# Altium schematic sheet BMS AFE - AFE.SchDoc: Title
size B; Organization: Midnight Sun Solar Rayce Car Team; Address1: University of Waterloo; Address2: 200 University Ave W; Address3: Waterloo, ON, Canada; Address4: N2L 3E9; DocumentNumber: 5; SheetNumber: 5; SheetTotal: 7; Website: www.uwmidsun.com; ProjectName: ProjectName
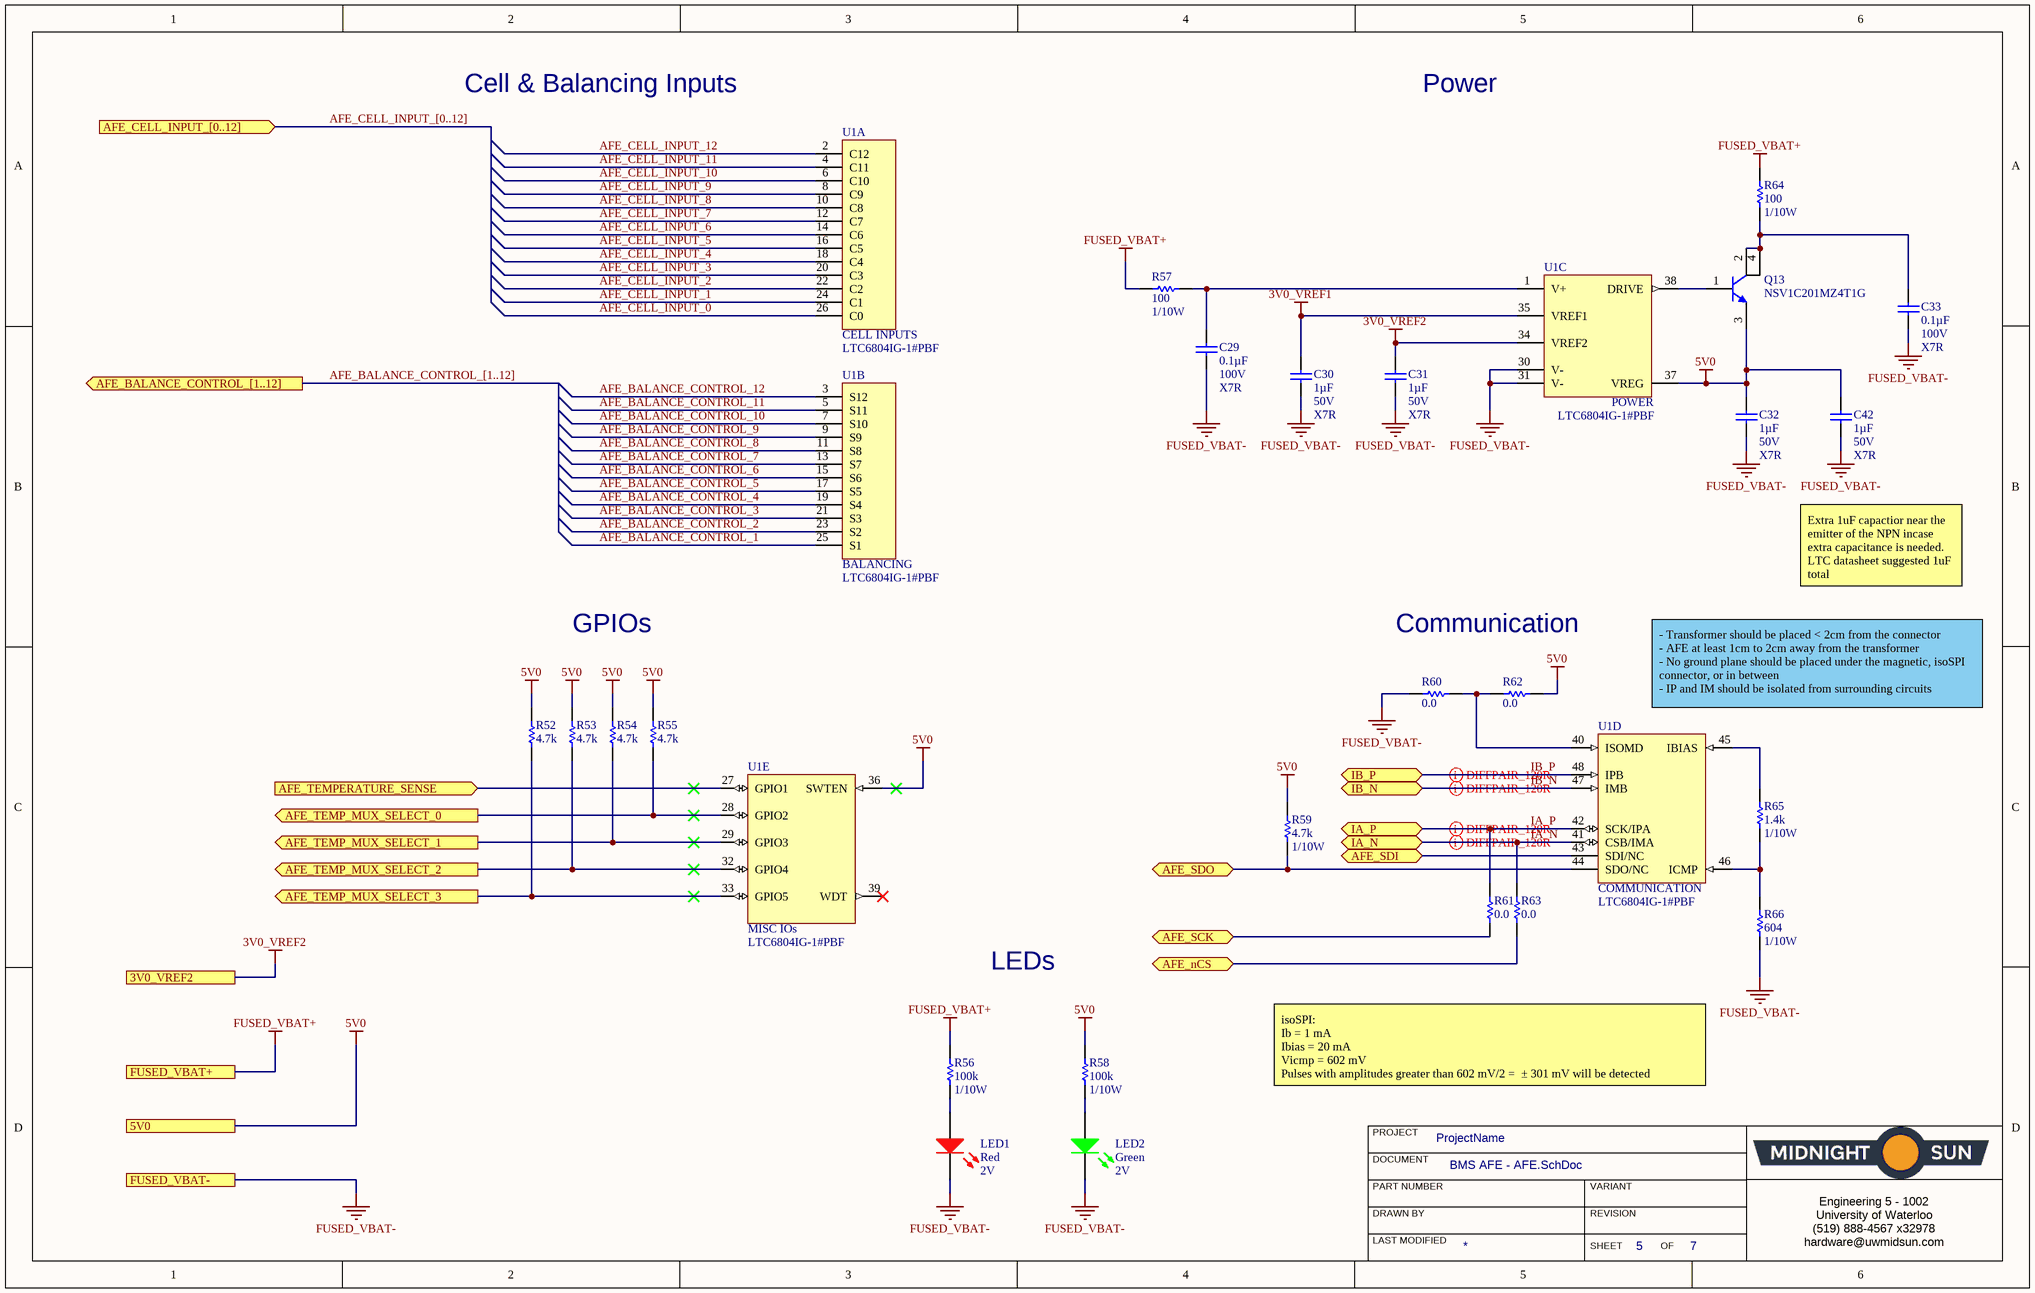
[diagram p0: BMS AFE - AFE.SchDoc]

## Parts
C29  Capacitance: 0.1µF  Voltage: 100V  Temperature Coefficient: X7R  [CAP, 0805]  (hidden comment: CAP CER 0.1UF 100V 10% X7R 0805)
C30  Capacitance: 1µF  Voltage: 50V  Temperature Coefficient: X7R  [CAP, 0603]  (hidden comment: CAP CER 1UF 50V 10% X7R 0603)
C31  Capacitance: 1µF  Voltage: 50V  Temperature Coefficient: X7R  [CAP, 0603]  (hidden comment: CAP CER 1UF 50V 10% X7R 0603)
C32  Capacitance: 1µF  Voltage: 50V  Temperature Coefficient: X7R  [CAP, 0603]  (hidden comment: CAP CER 1UF 50V 10% X7R 0603)
C33  Capacitance: 0.1µF  Voltage: 100V  Temperature Coefficient: X7R  [CAP, 0805]  (hidden comment: CAP CER 0.1UF 100V 10% X7R 0805)
C42  Capacitance: 1µF  Voltage: 50V  Temperature Coefficient: X7R  [CAP, 0603]  (hidden comment: CAP CER 1UF 50V 10% X7R 0603)
LED1  Color: Red  Voltage - Forward (Vf) (Typ): 2V  [LED_0603]  (hidden comment: LED RED CLEAR 2V 0603)
LED2  Color: Green  Voltage - Forward (Vf) (Typ): 2V  [LED_0603]  (hidden comment: LED GREEN CLEAR 2V 0603)
Q13  NSV1C201MZ4T1G  [BJT NPN 100V 2A SOT223]
R52  Resistance (Ohms): 4.7k  [RES, 0603]  (hidden comment: RES 4.7K OHM 1% 1/10W 0603)
R53  Resistance (Ohms): 4.7k  [RES, 0603]  (hidden comment: RES 4.7K OHM 1% 1/10W 0603)
R54  Resistance (Ohms): 4.7k  [RES, 0603]  (hidden comment: RES 4.7K OHM 1% 1/10W 0603)
R55  Resistance (Ohms): 4.7k  [RES, 0603]  (hidden comment: RES 4.7K OHM 1% 1/10W 0603)
R56  Resistance: 100k  Power: 1/10W  [RES, 0603]  (hidden comment: RES 100K OHM 5% 1/8W 0603)
R57  Resistance: 100  Power: 1/10W  [RES, 0603]  (hidden comment: RES 100 OHM 1% 1/10W 0603)
R58  Resistance: 100k  Power: 1/10W  [RES, 0603]  (hidden comment: RES 100K OHM 5% 1/8W 0603)
R59  Resistance (Ohms): 4.7k  Power (Watts): 1/10W  [RES, 0603]  (hidden comment: RES 4.7K OHM 1% 1/10W 0603)
R60  Resistance: 0.0  [RES, 0603]  (hidden comment: RES 0.0 OHM 1/4W 0603)
R61  Resistance: 0.0  [RES, 0603]  (hidden comment: RES 0.0 OHM 1/4W 0603)
R62  Resistance: 0.0  [RES, 0603]  (hidden comment: RES 0.0 OHM 1/4W 0603)
R63  Resistance: 0.0  [RES, 0603]  (hidden comment: RES 0.0 OHM 1/4W 0603)
R64  Resistance: 100  Power: 1/10W  [RES, 0603]  (hidden comment: RES 100 OHM 1% 1/10W 0603)
R65  Resistance: 1.4k  Power: 1/10W  [RES, 0603]  (hidden comment: RES 1.4k OHM 1% 1/10W 0603)
R66  Resistance: 604  Power: 1/10W  [RES, 0603]  (hidden comment: RES 604 OHM 1% 1/10W 0603)
U1  Manufacturer Part Number 1: LTC6804IG-1#PBF  [SSOP50P780X200-48N]  (hidden comment: IC MONITOR BATT STACK 48SSOP)  (parts A,B,C,D,E of 5)

## Ports
3V0_VREF2, 5V0, AFE_BALANCE_CONTROL_[1..12] (out), AFE_CELL_INPUT_[0..12] (in), AFE_nCS (bidir), AFE_SCK (bidir), AFE_SDI (bidir), AFE_SDO (bidir), AFE_TEMP_MUX_SELECT_0 (out), AFE_TEMP_MUX_SELECT_1 (out), AFE_TEMP_MUX_SELECT_2 (out), AFE_TEMP_MUX_SELECT_3 (out), AFE_TEMPERATURE_SENSE (in), FUSED_VBAT+, FUSED_VBAT-, IA_N (bidir), IA_P (bidir), IB_N (bidir), IB_P (bidir)

## Nets
3V0_VREF1: C30.1 U1.35(VREF1)
3V0_VREF2: C31.1 U1.34(VREF2) ; port 3V0_VREF2
5V0: C32.1 C42.1 Q13.3(E) R52.2 R53.2 R54.2 R55.2 R58.1 R59.1 R62.2 U1.36(SWTEN) U1.37(VREG) ; port 5V0
FUSED_VBAT+: R56.1 R57.1 R64.2 ; port FUSED_VBAT+
FUSED_VBAT-: C29.2 C30.2 C31.2 C32.2 C33.2 C42.2 LED1.2(K) LED2.2(K) R60.1 R66.2 U1.30(V-) U1.31(V-) ; port FUSED_VBAT-
AFE_BALANCE_CONTROL_1: U1.25(S1)
AFE_BALANCE_CONTROL_2: U1.23(S2)
AFE_BALANCE_CONTROL_3: U1.21(S3)
AFE_BALANCE_CONTROL_4: U1.19(S4)
AFE_BALANCE_CONTROL_5: U1.17(S5)
AFE_BALANCE_CONTROL_6: U1.15(S6)
AFE_BALANCE_CONTROL_7: U1.13(S7)
AFE_BALANCE_CONTROL_8: U1.11(S8)
AFE_BALANCE_CONTROL_9: U1.9(S9)
AFE_BALANCE_CONTROL_10: U1.7(S10)
AFE_BALANCE_CONTROL_11: U1.5(S11)
AFE_BALANCE_CONTROL_12: U1.3(S12)
AFE_CELL_INPUT_0: U1.26(C0)
AFE_CELL_INPUT_1: U1.24(C1)
AFE_CELL_INPUT_2: U1.22(C2)
AFE_CELL_INPUT_3: U1.20(C3)
AFE_CELL_INPUT_4: U1.18(C4)
AFE_CELL_INPUT_5: U1.16(C5)
AFE_CELL_INPUT_6: U1.14(C6)
AFE_CELL_INPUT_7: U1.12(C7)
AFE_CELL_INPUT_8: U1.10(C8)
AFE_CELL_INPUT_9: U1.8(C9)
AFE_CELL_INPUT_10: U1.6(C10)
AFE_CELL_INPUT_11: U1.4(C11)
AFE_CELL_INPUT_12: U1.2(C12)
AFE_nCS: R63.2 ; port AFE_nCS
AFE_SCK: R61.2 ; port AFE_SCK
AFE_SDI: U1.43(SDI/NC) ; port AFE_SDI
AFE_SDO: R59.2 U1.44(SDO/NC) ; port AFE_SDO
AFE_TEMP_MUX_SELECT_0: R55.1 U1.28(GPIO2) ; port AFE_TEMP_MUX_SELECT_0
AFE_TEMP_MUX_SELECT_1: R54.1 U1.29(GPIO3) ; port AFE_TEMP_MUX_SELECT_1
AFE_TEMP_MUX_SELECT_2: R53.1 U1.32(GPIO4) ; port AFE_TEMP_MUX_SELECT_2
AFE_TEMP_MUX_SELECT_3: R52.1 U1.33(GPIO5) ; port AFE_TEMP_MUX_SELECT_3
AFE_TEMPERATURE_SENSE: U1.27(GPIO1) ; port AFE_TEMPERATURE_SENSE
IA_N: R63.1 U1.41(CSB/IMA) ; port IA_N
IA_P: R61.1 U1.42(SCK/IPA) ; port IA_P
IB_N: U1.47(IMB) ; port IB_N
IB_P: U1.48(IPB) ; port IB_P
NetC29_1: C29.1 R57.2 U1.1(V+)
NetC33_1: C33.1 Q13.2(C) Q13.4(C) R64.1
NetLED1_1: LED1.1(A) R56.2
NetLED2_1: LED2.1(A) R58.2
NetQ13_1: Q13.1(B) U1.38(DRIVE)
NetR60_2: R60.2 R62.1 U1.40(ISOMD)
NetR65_1: R65.1 U1.45(IBIAS)
NetR65_2: R65.2 R66.1 U1.46(ICMP)

Not connected (* = marked no-connect by the designer): U1 39(WDT)*

## Buses and harness runs
bus AFE_BALANCE_CONTROL_[1..12] = port AFE_BALANCE_CONTROL_[1..12]
bus AFE_CELL_INPUT_[0..12] = port AFE_CELL_INPUT_[0..12]

## Layout directives
differential pair: IA_N, IA_P, IB_N, IB_P

## Notes on the sheet
- Cell & Balancing Inputs
- Power
- GPIOs
- Communication
- Extra 1uF capactior near the emitter of the NPN incase extra capacitance is needed. LTC datasheet suggested 1uF total
- (near U1) - Transformer should be placed < 2cm from the connector
  - AFE at least 1cm to 2cm away from the transformer
  - No ground plane should be placed under the magnetic, isoSPI connector, or in between
  - IP and IM should be isolated from surrounding circuits
- LEDs
- isoSPI:
  Ib = 1 mA
  Ibias = 20 mA
  Vicmp = 602 mV
  Pulses with amplitudes greater than 602 mV/2 =  ± 301 mV will be detected
- PROJECT
- DOCUMENT
- DRAWN BY
- LAST MODIFIED
- PART NUMBER
- REVISION
- SHEET
- VARIANT
- OF
- Engineering 5 - 1002
  University of Waterloo
  (519) 888-4567 x32978
  hardware@uwmidsun.com
- (in symbol IC MONITOR BATT STACK 48SSOP, part A) CELL INPUTS
- (in symbol IC MONITOR BATT STACK 48SSOP, part B) BALANCING
- (in symbol IC MONITOR BATT STACK 48SSOP, part C) POWER
- (in symbol IC MONITOR BATT STACK 48SSOP, part D) COMMUNICATION
- (in symbol IC MONITOR BATT STACK 48SSOP, part E) MISC IOs

## Library data of the parts
C29 C33 = CAP CER 0.1UF 100V 10% X7R 0805: 0.1µF ±10% 100V Ceramic Capacitor X7R 0805 (2012 Metric); Manufacturer 1: Murata Electronics North America; Manufacturer Part Number 1: GCM21BR72A104KA37L; Supplier 1: Digi-Key; Supplier Part Number 1: 490-4789-1-ND; Packaging: Cut Tape (CT); Part Status: Active; Operating Temperature: -55°C ~ 125°C; Ratings: AEC-Q200; Mounting Type: Surface Mount, MLCC; Package / Case: 0805 (2012 Metric); Size / Dimension: 0.079" L x 0.049" W (2.00mm x 1.25mm); Height - Seated (Max): -; Thickness (Max): 0.055" (1.40mm); Lead Spacing: -; Lead Style: -; ComponentLink1URL: http://www.murata.com/~/media/webrenewal/support/library/catalog/products/capacitor/mlcc/c03e.ashx; ComponentLink1Description: http://www.murata.com/~/media/webrenewal/support/library/catalog/products/capacitor/mlcc/c03e.ashx; Tolerance: ±10%
C30-C32 C42 = CAP CER 1UF 50V 10% X7R 0603: 1µF ±10% 50V Ceramic Capacitor X7R 0603 (1608 Metric); Manufacturer 1: Taiyo Yuden; Manufacturer Part Number 1: UMK107AB7105KA-T; Supplier 1: Digi-Key; Supplier Part Number 1: 587-3247-1-ND; Packaging: Cut Tape (CT); Part Status: Active; Operating Temperature: -55°C ~ 125°C; Ratings: -; Mounting Type: Surface Mount, MLCC; Package / Case: 0603 (1608 Metric); Size / Dimension: 0.063" L x 0.031" W (1.60mm x 0.80mm); Height - Seated (Max): -; Thickness (Max): 0.037" (0.95mm); Lead Spacing: -; Lead Style: -; ComponentLink1URL: http://www.yuden.co.jp/productdata/catalog/en/mlcc_all_e.pdf; ComponentLink1Description: http://www.yuden.co.jp/productdata/catalog/en/mlcc_all_e.pdf; Tolerance: ±10%
LED1 = LED RED CLEAR 2V 0603: Red 631nm LED Indication - Discrete 2V 0603 (1608 Metric); Manufacturer: Wurth Electronics Inc.; Manufacturer Part Number: 150060RS75000; Lens Color: Colorless; Millicandela Rating: 250mcd; Lens Style/Size: Rectangle with Flat Top, 1.10mm x 0.70mm; Current - Test: 20mA; Viewing Angle: 140°; Wavelength - Dominant: 625nm; Wavelength - Peak: 630nm; Supplier 1: Digi-Key; RoHS: RoHS Compliant; Category: Optoelectronics; Stock 1: 35521; Pricing 1: 1=0.21, 100=0.1617, 500=0.13964 (CAD); Packaging: Cut Tape (CT); Part Status: Active; Lens Transparency: Clear; Mounting Type: Surface Mount; Features: -; Package / Case: 0603 (1608 Metric); Supplier Device Package: 0603; Size / Dimension: 1.60mm L x 0.80mm W; Height (Max): 0.80mm; ComponentLink1URL: http://katalog.we-online.de/led/datasheet/150060RS75000.pdf; ComponentLink1Description: http://katalog.we-online.de/led/datasheet/150060RS75000.pdf; Supplier Part Number 1: 732-4978-1-ND
LED2 = LED GREEN CLEAR 2V 0603: Green 572nm LED Indication - Discrete 2V 0603 (1608 Metric); Manufacturer: Wurth Electronics Inc.; Manufacturer Part Number: 150060VS75000; Lens Color: Colorless; Millicandela Rating: 40mcd; Lens Style/Size: Rectangle with Flat Top, 1.10mm x 0.70mm; Current - Test: 20mA; Viewing Angle: 140°; Wavelength - Dominant: 570nm; Supplier 1: Digi-Key; RoHS: RoHS Compliant; Category: Optoelectronics; Stock 1: 9408; Pricing 1: 1=0.21, 100=0.1617, 500=0.13964 (CAD); Packaging: Cut Tape (CT); Part Status: Active; Lens Transparency: Clear; Mounting Type: Surface Mount; Wavelength - Peak: 572nm; Features: -; Package / Case: 0603 (1608 Metric); Supplier Device Package: 0603; Size / Dimension: 1.60mm L x 0.80mm W; Height (Max): 0.80mm; ComponentLink1URL: http://katalog.we-online.de/led/datasheet/150060VS75000.pdf; ComponentLink1Description: http://katalog.we-online.de/led/datasheet/150060VS75000.pdf; Supplier Part Number 1: 732-4980-1-ND
Q13 = BJT NPN 100V 2A SOT223: Bipolar (BJT) Transistor NPN 100V 2A 100MHz 800mW Surface Mount SOT-223 (TO-261); Manufacturer: ON Semiconductor; Vce Saturation (Max) @ Ib, Ic: 180mV @ 200mA, 2A; Current - Collector Cutoff (Max): 100nA (ICBO); DC Current Gain (hFE) (Min) @ Ic, Vce: 120 @ 500mA, 2V; Supplier 1: Digi-Key; Manufacturer Part Number: NSV1C201MZ4T1G; RoHS: RoHS Compliant; Category: Discrete Semiconductor Products; Stock 1: 2000; Pricing 1: 1=0.97, 10=0.825, 100=0.6158, 500=0.48386 (CAD); Packaging: Cut Tape (CT); Part Status: Active; Transistor Type: NPN; Frequency - Transition: 100MHz; Operating Temperature: -55°C ~ 150°C (TJ); Mounting Type: Surface Mount; Package / Case: TO-261-4, TO-261AA; Supplier Device Package: SOT-223 (TO-261); ComponentLink1URL: http://www.onsemi.com/pub/Collateral/NSS1C201MZ4-D.PDF; ComponentLink1Description: http://www.onsemi.com/pub/Collateral/NSS1C201MZ4-D.PDF; Supplier Part Number 1: NSV1C201MZ4T1GOSCT-ND
R52-R55 R59 = RES 4.7K OHM 1% 1/10W 0603: 4.7k Ohm ±1% 0.1W, 1/10W Chip Resistor 0603 (1608 Metric) Moisture Resistant Thick Film; Manufacturer 1: Yageo; Manufacturer Part Number 1: RC0603FR-074K7L; Description 1: RES SMD 4.7K OHM 1% 1/10W 0603; Temperature Coefficient: ±100ppm/°C; Supplier 1: Digi-Key; Supplier Part Number 1: 311-4.70KHRCT-ND; RoHS: RoHS Compliant; Category: Resistors; Stock 1: 3487566; Pricing 1: 1=0.16, 10=0.022, 100=0.0089, 1000=0.00402, 2500=0.00349 (CAD); Packaging: Cut Tape (CT); Part Status: Active; Composition: Thick Film; Features: Moisture Resistant; Operating Temperature: -55°C ~ 155°C; Package / Case: 0603 (1608 Metric); Supplier Device Package: 0603; Size / Dimension: 0.063" L x 0.031" W (1.60mm x 0.80mm); Height - Seated (Max): 0.022" (0.55mm); Failure Rate: -; ComponentLink1URL: http://www.yageo.com/documents/recent/PYu-RC_Group_51_RoHS_L_7.pdf; ComponentLink1Description: http://www.yageo.com/documents/recent/PYu-RC_Group_51_RoHS_L_7.pdf; Tolerance: ±1%
  R52-R55: Power (Watts): 1/10W
R56 R58 = RES 100K OHM 5% 1/8W 0603: RES SMD 100K OHM 5% 1/10W 0603; Manufacturer 1: Yageo; Manufacturer Part Number 1: RC0603JR-07100KL; Temperature Coefficient: ±100ppm/°C; Supplier 1: Digi-Key; Supplier Part Number 1: 311-100KGRCT-ND; Packaging: Cut Tape (CT); Part Status: Active; Composition: Thick Film; Operating Temperature: -55°C ~ 155°C; Package / Case: 0603 (1608 Metric); Supplier Device Package: 0603; Size / Dimension: 0.063" L x 0.031" W (1.60mm x 0.80mm); Height - Seated (Max): 0.022" (0.55mm); Failure Rate: -; ComponentLink1URL: http://www.yageo.com/documents/recent/PYu-RC_Group_51_RoHS_L_7.pdf; ComponentLink1Description: http://www.yageo.com/documents/recent/PYu-RC_Group_51_RoHS_L_7.pdf; Tolerance: ±5%
R57 R64 = RES 100 OHM 1% 1/10W 0603: 100 Ohm ±1% 0.1W, 1/10W Chip Resistor 0603 (1608 Metric) Moisture Resistant Thick Film; Manufacturer 1: Yageo; Manufacturer Part Number 1: RC0603FR-07100RL; Temperature Coefficient: ±100ppm/°C; Supplier 1: Digi-Key; Supplier Part Number 1: 311-100HRCT-ND; Packaging: Cut Tape (CT); Part Status: Active; Composition: Thick Film; Operating Temperature: -55°C ~ 155°C; Package / Case: 0603 (1608 Metric); Supplier Device Package: 0603; Size / Dimension: 0.063" L x 0.031" W (1.60mm x 0.80mm); Height - Seated (Max): 0.022" (0.55mm); Failure Rate: -; ComponentLink1URL: http://www.yageo.com/documents/recent/PYu-RC_Group_51_RoHS_L_7.pdf; ComponentLink1Description: http://www.yageo.com/documents/recent/PYu-RC_Group_51_RoHS_L_7.pdf; Tolerance: ±1%
R60-R63 = RES 0.0 OHM 1/4W 0603: RES SMD 0.0 OHM JUMPER 1/4W 0603; Manufacturer 1: Vishay Dale; Manufacturer Part Number 1: CRCW06030000Z0EAHP; Supplier 1: Digi-Key; Supplier Part Number 1: 541-0.0SBCT-ND; Packaging: Cut Tape (CT); Part Status: Active; Composition: Thick Film; Operating Temperature: -55°C ~ 155°C; Package / Case: 0603 (1608 Metric); Supplier Device Package: 0603; Size / Dimension: 0.063" L x 0.033" W (1.60mm x 0.85mm); Height - Seated (Max): 0.022" (0.55mm); Failure Rate: -; ComponentLink1URL: http://www.vishay.com/docs/20043/crcwhpe3.pdf; ComponentLink1Description: http://www.vishay.com/docs/20043/crcwhpe3.pdf; Power (Watts): 1/4W
R65 = RES 1.4k OHM 1% 1/10W 0603: RES SMD 1.4K OHM 1% 1/10W 0603; Manufacturer 1: Yageo; Manufacturer Part Number 1: RC0603FR-071K4L; Temperature Coefficient: ±100ppm/°C; Supplier 1: Digi-Key; Supplier Part Number 1: 311-1.40KHRCT-ND; Packaging: Cut Tape (CT); Part Status: Active; Composition: Thick Film; Operating Temperature: -55°C ~ 155°C; Package / Case: 0603 (1608 Metric); Supplier Device Package: 0603; Size / Dimension: 0.063" L x 0.031" W (1.60mm x 0.80mm); Height - Seated (Max): 0.022" (0.55mm); Failure Rate: -; ComponentLink1URL: http://www.yageo.com/documents/recent/PYu-RC_Group_51_RoHS_L_7.pdf; ComponentLink1Description: http://www.yageo.com/documents/recent/PYu-RC_Group_51_RoHS_L_7.pdf; Tolerance: ±1%
R66 = RES 604 OHM 1% 1/10W 0603: RES SMD 604 OHM 1% 1/10W 0603; Manufacturer 1: Yageo; Manufacturer Part Number 1: RC0603FR-07604RL; Temperature Coefficient: ±100ppm/°C; Supplier 1: Digi-Key; Supplier Part Number 1: 311-604HRCT-ND; Packaging: Cut Tape (CT); Part Status: Active; Composition: Thick Film; Operating Temperature: -55°C ~ 155°C; Package / Case: 0603 (1608 Metric); Supplier Device Package: 0603; Size / Dimension: 0.063" L x 0.031" W (1.60mm x 0.80mm); Height - Seated (Max): 0.022" (0.55mm); Failure Rate: -; ComponentLink1URL: http://www.yageo.com/documents/recent/PYu-RC_Group_51_RoHS_L_7.pdf; ComponentLink1Description: http://www.yageo.com/documents/recent/PYu-RC_Group_51_RoHS_L_7.pdf; Tolerance: ±1%
U1 = IC MONITOR BATT STACK 48SSOP: Battery Battery Monitor IC Multi-Chemistry 48-SSOP; Manufacturer 1: Linear Technology; Number of Cells: 1 ~ 12; Fault Protection: Over/Under Voltage; Interface: I²C, SPI; Supplier 1: Digi-Key; Supplier Part Number 1: LTC6804IG-1#PBF-ND; Packaging: Tube; Part Status: Active; Function: Battery Monitor; Battery Chemistry: Multi-Chemistry; Operating Temperature: -40°C ~ 85°C (TA); Package / Case: 48-FSOP (0.209", 5.30mm Width); Supplier Device Package: 48-SSOP; ComponentLink1URL: http://www.linear.com/docs/43171; ComponentLink1Description: http://www.linear.com/docs/43171